# Altium schematic sheet USB Type C Connector ESD.SchDoc: USB Type C Connection
size Tabloid; ApprovedBy: NA; CompanyName: Cospan Design LLC; DrawnBy: David McCoy; Engineer: David McCoy; DocumentNumber: 7; Revision: D; SheetNumber: 7; SheetTotal: 18; Client: OSH; ProjectPrettyName: Guppy Buddy; Project: Guppy Buddy
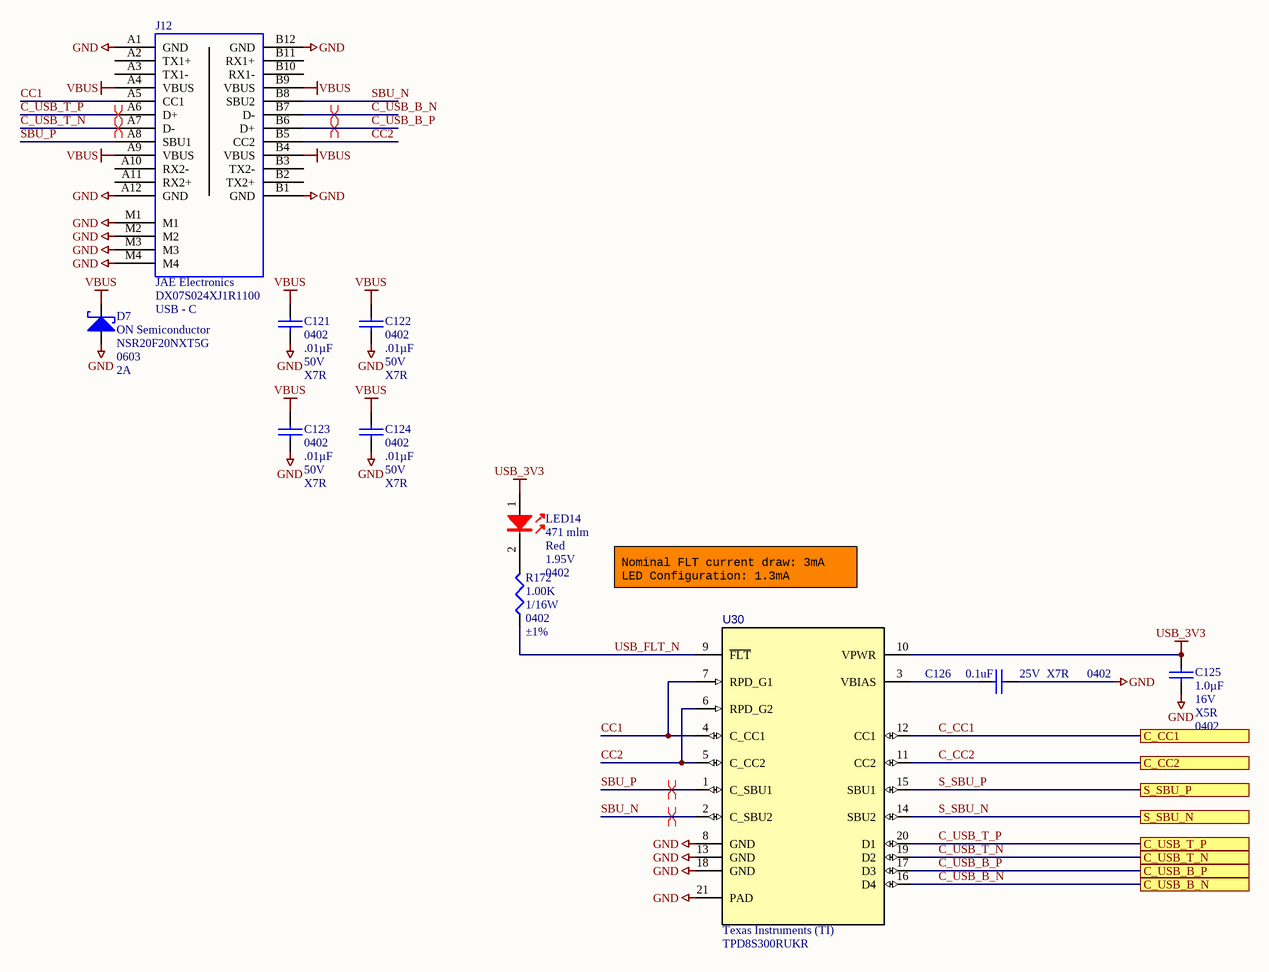
[diagram p0: USB Type C Connector ESD.SchDoc]

## Parts
C121  Package / Case: 0402  Capacitance: .01µF  Voltage - Rated: 50V  Temperature Coefficient: X7R  [C_ERA-0402]  (hidden comment: 10000pF)
C122  Package / Case: 0402  Capacitance: .01µF  Voltage - Rated: 50V  Temperature Coefficient: X7R  [C_ERA-0402]  (hidden comment: 10000pF)
C123  Package / Case: 0402  Capacitance: .01µF  Voltage - Rated: 50V  Temperature Coefficient: X7R  [C_ERA-0402]  (hidden comment: 10000pF)
C124  Package / Case: 0402  Capacitance: .01µF  Voltage - Rated: 50V  Temperature Coefficient: X7R  [C_ERA-0402]  (hidden comment: 10000pF)
C125  Capacitance: 1.0µF  Voltage - Rated: 16V  Temperature Coefficient: X5R  Package / Case: 0402  [C_0402]  (hidden comment: 1.0uF)
C126  Capacitance: 0.1uF  Voltage - Rated: 25V  Temperature Coefficient: X7R  Package / Case: 0402  [C_0402]  (hidden comment: C_0402_0.1UF_25V)
D7  Manufacturer: ON Semiconductor  Manufacturer Part Number: NSR20F20NXT5G  Case/Package: 0603  Average Rectified Current: 2A  [DSN2_0603]  (hidden comment: D_SCHOTT_30V_2A_XDFN)
J12  Manufacturer: JAE Electronics  Connector Type: USB - C  [DX07S024XJ1R1100]  (hidden comment: J_DX07S024XJ1R1100)
LED14  Luminous Flux @ Current - Test: 471 mlm  Color: Red  Voltage - Forward (Vf) Typ: 1.95V  Package / Case: 0402  [DIOM1005X07L_RED]  (hidden comment: LED_RED_0402)
R172  Resistance In Ohms: 1.00K  Power (Watts): 1/16W  Case: 0402  Tolerance: ±1%  [R_0402]  (hidden comment: 1.0k Ohms)
U30  Manufacturer: Texas Instruments (TI)  Manufacturer Part Number: TPD8S300RUKR  [RUK0020B]  (hidden comment: U_TPD8S300RUK)

## Ports
C_CC1, C_CC2, C_USB_B_N, C_USB_B_P, C_USB_T_N, C_USB_T_P, S_SBU_N, S_SBU_P

## Nets
GND: C121.1 C122.1 C123.1 C124.1 C125.1 C126.1 D7.2(A) J12.A1(GND) J12.A12(GND) J12.B1(GND) J12.B12(GND) J12.M1 J12.M2 J12.M3 J12.M4 U30.8(GND) U30.13(GND) U30.18(GND) U30.21(PAD)
USB_3V3: C125.2 LED14.1 U30.10(VPWR)
VBUS: C121.2 C122.2 C123.2 C124.2 D7.1(C) J12.A4(VBUS) J12.A9(VBUS) J12.B4(VBUS) J12.B9(VBUS)
C_CC1: U30.12(CC1) ; port C_CC1
C_CC2: U30.11(CC2) ; port C_CC2
C_USB_B_N: J12.B7(D-) U30.16(D4) ; port C_USB_B_N
C_USB_B_P: J12.B6(D+) U30.17(D3) ; port C_USB_B_P
C_USB_T_N: J12.A7(D-) U30.19(D2) ; port C_USB_T_N
C_USB_T_P: J12.A6(D+) U30.20(D1) ; port C_USB_T_P
CC1: J12.A5(CC1) U30.4(C_CC1) U30.7(RPD_G1)
CC2: J12.B5(CC2) U30.5(C_CC2) U30.6(RPD_G2)
S_SBU_N: U30.14(SBU2) ; port S_SBU_N
S_SBU_P: U30.15(SBU1) ; port S_SBU_P
SBU_N: J12.B8(SBU2) U30.2(C_SBU2)
SBU_P: J12.A8(SBU1) U30.1(C_SBU1)
USB_FLT_N: R172.2 U30.9(~{FLT})
NetC126_2: C126.2 U30.3(VBIAS)
NetLED14_2: LED14.2 R172.1

Not connected (* = marked no-connect by the designer): J12 A2(TX1+) A3(TX1-) A10(RX2-) A11(RX2+) B2(TX2+) B3(TX2-) B10(RX1-) B11(RX1+)

## Layout directives
differential pair: C_USB_B_N, C_USB_B_P, C_USB_T_N, C_USB_T_P, SBU_N, SBU_P

## Notes on the sheet
- Nominal FLT current draw: 3mA
  LED Configuration: 1.3mA
- Project:
- http://www.cospandesign.com
- Cospan Design
- Document:
- Engineer:
- Title:
- Client:
- Approved By:
- Revision:
- Date:
- Number:
- of

## Library data of the parts
C121-C124 = C_0402_10000PF_50V: CAP CERAMIC .01UF 50V X7R 0402; Manufacturer: Murata Electronics North America; Manufacturer Part Number: GRM155R71H103KA88D; Tolerance: ±10%; Supplier 1: Digi-Key; RoHS: RoHS Compliant; Category: Capacitors; Stock 1: 7255009; Pricing 1: 1=0.1, 50=0.0052, 100=0.0044, 250=0.00364, 500=0.00312, 1000=0.00242, 5000=0.00202 (USD); Packaging: Cut Tape (CT); Part Status: Active; Operating Temperature: -55°C ~ 125°C; Features: -; Ratings: -; Applications: General Purpose; Mounting Type: Surface Mount, MLCC; Size / Dimension: 0.039" L x 0.020" W (1.00mm x 0.50mm); Height - Seated (Max): -; Thickness (Max): 0.022" (0.55mm); Lead Spacing: -; Lead Style: -; ComponentLink1URL: http://www.murata.com/~/media/webrenewal/support/library/catalog/products/capacitor/mlcc/c02e.ashx; ComponentLink1Description: http://www.murata.com/~/media/webrenewal/support/library/catalog/products/capacitor/mlcc/c02e.ashx; Supplier Part Number 1: 490-4516-1-ND
C125 = C_0402_1.0UF_16V: CAP CER 1.0UF 16V X5R 0402; Manufacturer 1: Samsung; Manufacturer Part Number 1: CL05A105KO5NNNC; Tolerance: 10%; Description 1: Cap Ceramic 1uF 16V X5R 10% SMD 0402 85C Paper T/R; Supplier 1: Digi-Key; Stock 1: 26908; Pricing 1: 1=0.1, 10=0.062, 100=0.0276, 500=0.01968, 1000=0.01547, 2500=0.01406, 5000=0.01294 (USD); Packaging: Tape and Reel; ComponentLink1URL: http://ds.yuden.co.jp/TYCOMPAS/ut/detail.do?productNo=EMK105BJ105KV-F&fileName=EMK105BJ105KV-F_SS&mode=specSheetDownload; ComponentLink1Description: http://ds.yuden.co.jp/TYCOMPAS/ut/detail.do?productNo=EMK105BJ105KV-F&fileName=EMK105BJ105KV-F_SS&mode=specSheetDownload; Supplier Part Number 1: 1276-1067-6-ND; ComponentLink2URL: https://datasheet.ciiva.com/16207/cl05a105ko5nnnc-16207571.pdf; ComponentLink2Description: https://datasheet.ciiva.com/16207/cl05a105ko5nnnc-16207571.pdf; ComponentLink3URL: https://datasheet.ciiva.com/15195/getdatasheetpartid-355272-15195629.pdf; ComponentLink3Description: https://datasheet.ciiva.com/15195/getdatasheetpartid-355272-15195629.pdf; Mount: Surface Mount; Case/Package: 0402; Case Code (Metric): 1005; Case Code (Imperial): 0402; Contact Plating: Tin; Min Operating Temperature: -55°C; Max Operating Temperature: 85°C; Dielectric: X5R; Package Quantity: 1; Voltage Rating: 16V; Voltage: 16V; Length: 1mm; Height: 0.5mm; Width: 0.02inch; Thickness: 0.022inch; Depth: 0.5mm; Radiation Hardening: No
C126 = C_0402_0.1UF_25V: CAP CER 0.1UF 25V X6S 0402; Manufacturer 1: Yageo; Manufacturer Part Number 1: CC0402KRX7R8BB104; Description 1: Cap Ceramic 0.1uF 25V X7R 10% SMD 0402 125C Paper T/R; Tolerance: 10%; Dissipation Factor: 3.5%; ComponentLink1URL: https://product.tdk.com/info/en/catalog/datasheets/mlcc_commercial_general_en.pdf; ComponentLink1Description: https://product.tdk.com/info/en/catalog/datasheets/mlcc_commercial_general_en.pdf; Supplier 1: Digi-Key; Supplier Part Number 1: 311-2077-1-ND; Stock 1: 0; Pricing 1: 1=0.1, 10=0.048, 100=0.0215, 500=0.01534, 1000=0.01205, 2500=0.01095, 5000=0.01007 (USD); Mount: Surface Mount; Case/Package: 0402; Case Code (Imperial): 0402; Case Code (Metric): 1005; Min Operating Temperature: -55°C; Max Operating Temperature: 125°C; Voltage Rating: 25V; Voltage Rating (DC): 25V; Packaging: Tape and Reel; Dielectric: X7R; Termination: SMD/SMT; Composition: Ceramic; Length: 1mm; Height: 0.5mm; Width: 0.02inch; Thickness: 0.022inch; Depth: 0.5mm; Radiation Hardening: No; Lead Free: Lead Free; Halogen Free: Halogen Free; ComponentLink2URL: https://datasheet.ciiva.com/11464/upy-gphc-x7r-6-3v-to-50v-8-11464889.pdf; ComponentLink2Description: https://datasheet.ciiva.com/11464/upy-gphc-x7r-6-3v-to-50v-8-11464889.pdf; ComponentLink3URL: https://datasheet.ciiva.com/13210/upy-gphc-x7r-6-3v-to-50v-8-12304-13210908.pdf; ComponentLink3Description: https://datasheet.ciiva.com/13210/upy-gphc-x7r-6-3v-to-50v-8-12304-13210908.pdf; ComponentLink4URL: https://datasheet.ciiva.com/17437/upy-gphc-x7r-6-3v-to-50v-8-17437357.pdf; ComponentLink4Description: https://datasheet.ciiva.com/17437/upy-gphc-x7r-6-3v-to-50v-8-17437357.pdf
D7 = D_SCHOTT_30V_2A_XDFN: Diode Schottky 30V 2A (DC) Surface Mount 2-DSN (1.6x.80); Max Surge Current: 28A; Peak Reverse Current: 150uA; Forward Voltage: 480mV; Max Power Dissipation: 1.75W; Element Configuration: Single; Supplier 1: Digikey; Stock 1: 24771; Pricing 1: 1=0.57, 10=0.458, 100=0.3118, 500=0.2339, 1000=0.1754 (USD); Number of Pins: 2; Min Operating Temperature: -40°C; Max Operating Temperature: 150°C; Forward Current: 2A; Package Quantity: 1; Packaging: Tape and Reel; Max Reverse Leakage Current: 150uA; Reverse Voltage (DC): 30V; Max Repetitive Reverse Voltage (Vrrm): 30V; Max Forward Surge Current (Ifsm): 28A; Peak Non-Repetitive Surge Current: 28A; Radiation Hardening: No; REACH SVHC: No SVHC; Lead Free: Lead Free; ComponentLink1URL: https://datasheet.ciiva.com/22663/nsr20f30-d-22663701.pdf; ComponentLink1Description: https://datasheet.ciiva.com/22663/nsr20f30-d-22663701.pdf; ComponentLink2URL: https://datasheet.ciiva.com/4714/nsr20f30-118998-4714087.pdf; ComponentLink2Description: https://datasheet.ciiva.com/4714/nsr20f30-118998-4714087.pdf; ComponentLink3URL: https://datasheet.ciiva.com/16474/nsr20f30-d-16474535.pdf; ComponentLink3Description: https://datasheet.ciiva.com/16474/nsr20f30-d-16474535.pdf; ComponentLink4URL: https://datasheet.ciiva.com/915/nsr20f30-d-915929.pdf; ComponentLink4Description: https://datasheet.ciiva.com/915/nsr20f30-d-915929.pdf; ComponentLink5URL: https://datasheet.ciiva.com/915/nsr20f30-d-915930.pdf; ComponentLink5Description: https://datasheet.ciiva.com/915/nsr20f30-d-915930.pdf; ComponentLink6URL: https://datasheet.ciiva.com/915/nsr20f30-d-915931.pdf; ComponentLink6Description: https://datasheet.ciiva.com/915/nsr20f30-d-915931.pdf; Supplier Part Number 1: NSR20F30NXT5GOSDKR-ND
J12 = J_DX07S024XJ1R1100: CONN RCPT USB C TOP MNT HYBRID; Number of Contacts: 24; Gender: Receptacle; Specifications: USB 3.1, Superspeed+; Supplier 1: Digi-Key; RoHS: RoHS Compliant; Category: Connectors, Interconnects; Stock 1: 1709; Pricing 1: 1=2.85, 10=2.587, 25=2.4288, 50=2.3232, 100=2.2176, 250=2.0064, 500=1.848 (USD); Packaging: Cut Tape (CT); Part Status: Active; Mounting Type: Surface Mount, Right Angle; Through Hole; Features: Board Guide; Ingress Protection: -; ComponentLink1URL: http://media.digikey.com/pdf/Data%20Sheets/JAE%20PDFs/DX07S024XJ1_Dwg.pdf; ComponentLink1Description: http://media.digikey.com/pdf/Data%20Sheets/JAE%20PDFs/DX07S024XJ1_Dwg.pdf; Supplier Part Number 1: 670-2848-1-ND; Manufacturer Part Number: DX07S024XJ1R1100
LED14 = LED_RED_0402: LED 1X0.5MM 630NM RD WTR CLR SMD; Manufacturer: Kingbright Corp; Manufacturer Part Number: APHHS1005SURCK; Current - Test: 20mA; Wavelength - Peak: 650nm; Millicandela Rating: 150mcd; Lens Type: Clear; Lens Style/Size: Rectangle, 0.8mm x 0.5mm; Viewing Angle: 120°; Supplier 1: Digi-Key; Supplier Part Number 1: 754-1104-1-ND; RoHS: RoHS Compliant; Category: Optoelectronics; Stock 1: 32842; Pricing 1: 1=0.3, 10=0.221, 25=0.1772, 100=0.1623, 250=0.14752, 500=0.13276, 1000=0.118 (USD); Wavelength - Dominant: 630nm; Mounting Type: Surface Mount; Packaging: Cut Tape (CT); ComponentLink1URL: http://www.us.kingbright.com/images/catalog/SPEC/APHHS1005SURCK.pdf; ComponentLink1Description: http://www.us.kingbright.com/images/catalog/SPEC/APHHS1005SURCK.pdf
R172 = R_0402_1.0K: RES 1.00K OHM 1/16W 1% 0402 SMD; Manufacturer: Yageo; Manufacturer Part Number: RC0402FR-071KL; Resistance (Ohms): 1K; Temperature Coefficient: ±100ppm/°C; Supplier 1: Digi-Key; Supplier Part Number 1: 311-1.00KLRCT-ND; RoHS: RoHS Compliant; Category: Resistors; Stock 1: 2103351; Pricing: 10=0.014, 100=0.0063, 500=0.00382, 1000=0.0027, 5000=0.00203 (USD); Composition: Thick Film; Features: -; Package / Case: 0402 (1005 Metric); Size / Dimension: 0.039" L x 0.020" W (1.00mm x 0.50mm); Height: 0.016" (0.40mm); Number of Terminations: 2; Packaging: Cut Tape (CT); ComponentLink1URL: http://www.yageo.com/documents/recent/PYu-RC0402_51_RoHS_L_6.pdf; ComponentLink1Description: http://www.yageo.com/documents/recent/PYu-RC0402_51_RoHS_L_6.pdf
U30 = U_TPD8S300RUK: USB Type C Interface Protector: Short-to-VBUS Over Voltage and IEC 61000-4-2 ESD Protection, RUK0020B; Capacitance: 1.5pF; Supplier 1: Digi-Key; Stock 1: 2830; Pricing 1: 1=2.65, 10=2.377, 100=1.9109, 500=1.57, 1000=1.3008 (USD); Lead Free: Lead Free; Supplier Part Number 1: 296-45177-6-ND